# EAGLE design OSO-MISC-20-020 Programming Board for Ring (EAGLE 9.6.2)
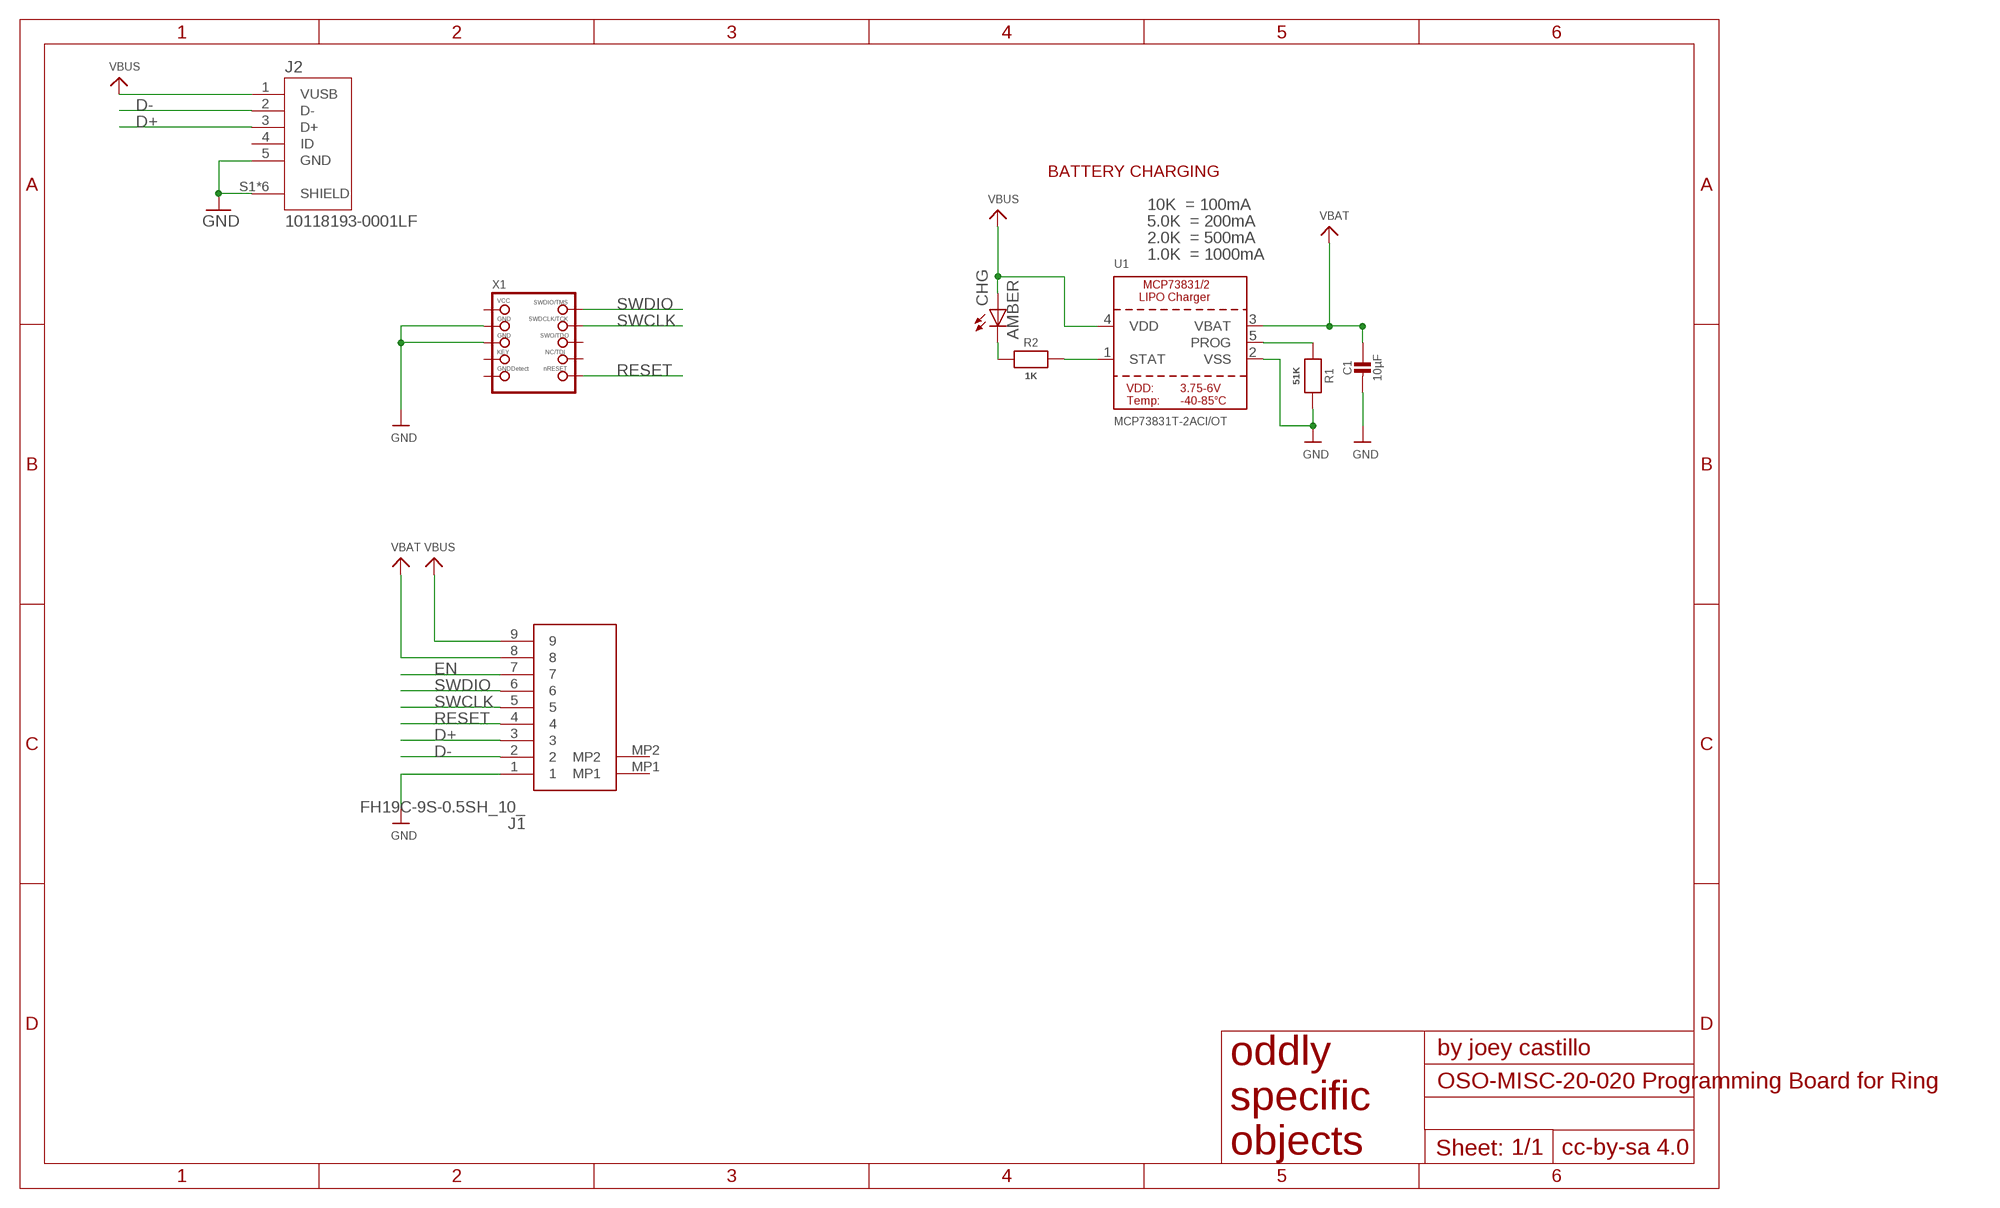
[diagram p0: schematic, sheet 1]

## Parts
C1  10µF  CAP_CERAMIC0805-NOOUTLINE  [0805-NO]
CHG  AMBER  LEDCHIPLED_0805  [CHIPLED_0805]
J1  FH19C-9S-0.5SH_10_  [FH19C9S05SH10]
J2  10118193-0001LF  [FCI_10118193-0001LF]
R1  51K  RESISTOR0805_NOOUTLINE  [0805-NO]
R2  1K  RESISTOR0805_NOOUTLINE  [0805-NO]
U1  MCP73831T-2ACI/OT  MCP73831/2  [SOT23-5]
X1  JTAG-CORTEXBOX  [2X05_1.27MM_BOX_NOPOSTS]

## Nets
D+: J1.3 J2.3(D+)
D-: J1.2 J2.2(D-)
EN: J1.7
GND [gnd]: C1.2 J1.1 J2.5(GND) J2.S1(SHIELD) J2.S2(SHIELD) J2.S3(SHIELD) J2.S4(SHIELD) J2.S5(SHIELD) J2.S6(SHIELD) R1.2 U1.2(VSS) X1.3(GND) X1.5(GND)
N$4: CHG.C R2.1
PROG: R1.1 U1.5(PROG)
RESET: J1.4 X1.10(NRESET)
STAT: R2.2 U1.1(STAT)
SWCLK: J1.5 X1.4(SWDCLK)
SWDIO: J1.6 X1.2(SWDIO)
VBAT [power]: C1.1 J1.8 U1.3(VBAT)
VBUS [power]: CHG.A J1.9 J2.1(VUSB) U1.4(VDD)
Unconnected: J1.MP1 J1.MP2 J2.4(ID) X1.6(SWO) X1.7(KEY) X1.8(TDI) X1.9(GNDDETECT)

## Notes on the sheet
- BATTERY CHARGING
- 10K  = 100mA
- 5.0K  = 200mA
- 2.0K  = 500mA
- 1.0K  = 1000mA

## Power pins joined to a net without a drawn wire
VCC: X1.1(VCC)

## Library data of the parts
C1 = microbuilder:CAP_CERAMIC: Ceramic Capacitors For new designs, use the packages preceded by an '_' character since they are more reliable: The following footprints should be used on most boards: _0402 - Standard footprint for regular board layouts _0603 - Standard footprint for regular board layouts _0805 - Standard footprint for regular board layouts _1206 - Standard footprint for regular board layouts For extremely tight-pitch boards where space is at a premium, the following 'micro-pitch' footprints can be used (smaller pads, no silkscreen outline, etc.): _0402MP - Micro-pitch footprint for very dense/compact boards _0603MP - Micro-pitch footprint for very dense/compact boards _0805MP - Micro-pitch footprint for very dense/compact boards _1206MP - Micro-pitch footprint for very dense/compact boards
CHG = adafruit:LED: LED OSRAM: - CHIPLED LG R971, LG N971, LY N971, LG Q971, LY Q971, LO R971, LY R971 LH N974, LH R974 LS Q976, LO Q976, LY Q976 LO Q996 - Hyper CHIPLED LW Q18S LB Q993, LB Q99A, LB R99A - SideLED LS A670, LO A670, LY A670, LG A670, LP A670 LB A673, LV A673, LT A673, LW A673 LH A674 LY A675 LS A676, LA A676, LO A676, LY A676, LW A676 LS A679, LY A679, LG A679 - Hyper Micro SIDELED® LS Y876, LA Y876, LO Y876, LY Y876 LT Y87S - SmartLED LW L88C, LW L88S LB L89C, LB L89S, LG L890 LS L89K, LO L89K, LY L89K LS L896, LA L896, LO L896, LY L896 - TOPLED LS T670, LO T670, LY T670, LG T670, LP T670 LSG T670, LSP T670, LSY T670, LOP T670, LYG T670 LG T671, LOG T671, LSG T671 LB T673, LV T673, LT T673, LW T673 LH T674 LS T676, LA T676, LO T676, LY T676, LB T676, LH T676, LSB T676, LW T676 LB T67C, LV T67C, LT T67C, LS T67K, LO T67K, LY T67K, LW E67C LS E67B, LA E67B, LO E67B, LY E67B, LB E67C, LV E67C, LT E67C LW T67C LS T679, LY T679, LG T679 LS T770, LO T770, LY T770, LG T770, LP T770 LB T773, LV T773, LT T773, LW T773 LH T774 LS E675, LA E675, LY E675, LS T675 LS T776, LA T776, LO T776, LY T776, LB T776 LHGB T686 LT T68C, LB T68C - Hyper Mini TOPLED® LB M676 - Mini TOPLED Santana® LG M470 LS M47K, LO M47K, LY M47K Source: http://www.osram.convergy.de/
J1 = FH19C-9S-0.5SH:FH19C-9S-0.5SH_10_: CONN FFC BOTTOM 9POS 0.50MM R/A Source: Datasheet <https://componentsearchengine.com/Datasheets/1/FH19C-9S-0.5SH(10).pdf>; DESCRIPTION: CONN FFC BOTTOM 9POS 0.50MM R/A; HEIGHT: 1mm; MANUFACTURER_NAME: Hirose; MANUFACTURER_PART_NUMBER: FH19C-9S-0.5SH(10); MOUSER_PART_NUMBER: 798-FH19C9S05SH10; MOUSER_PRICE-STOCK: https://www.mouser.co.uk/ProductDetail/Hirose-Connector/FH19C-9S-05SH10?qs=vnk2wBG9e15bX8eK%2FvDSMA%3D%3D
J2 = 10118193-0001LF:10118193-0001LF: Micro USB B Type Receptacle; DESCRIPTION: Single Port 5 Contact Shielded SMT MICRO USB B-Type Receptacle; DIGI-KEY_PART_NUMBER: 609-4616-1-ND; DIGI-KEY_PURCHASE_URL: https://www.digikey.com/product-detail/en/amphenol-icc-fci/10118193-0001LF/609-4616-1-ND/2785380?utm_source=snapeda&utm_medium=aggregator&utm_campaign=symbol; MF: Amphenol ICC; MP: 10118193-0001LF; PACKAGE: None
R1 R2 = microbuilder:RESISTOR: Resistors For new designs, use the packages preceded by an '_' character since they are more reliable: The following footprints should be used on most boards: _0402 - Standard footprint for regular board layouts _0603 - Standard footprint for regular board layouts _0805 - Standard footprint for regular board layouts _1206 - Standard footprint for regular board layouts For extremely tight-pitch boards where space is at a premium, the following 'micro-pitch' footprints can be used (smaller pads, no silkscreen outline, etc.): _0402MP - Micro-pitch footprint for very dense/compact boards _0603MP - Micro-pitch footprint for very dense/compact boards _0805MP - Micro-pitch footprint for very dense/compact boards _1206MP - Micro-pitch footprint for very dense/compact boards
U1 = microbuilder:MCP73831/2: MCP73831/2 LIPO Charger VDD: 3.75 - 6V Temp -40 - 85°C Programmable Charge Rate: 15-500mA NOTE: STAT is a tri-state logic output on the MCP73831 and an open-drain output on the MCP73832. SOT23-5 with 4.2V output and tri-state logic on STAT = MCP73831T-2ACI/OT
X1 = pygamer-microbuilder:JTAG-CORTEX: Serial Wire (SW-DP) Connector Standard 0.05" 10-pin connector is for use with the Cortex M and Cortex A SWD (serial wire debugger) interface (SW-DP) Connectors 2x05_1.27MM_SMT - Inexpensive surface-mount header with bare pins, compatible with standard 10-pin SWD cables (4UCON: 16846) 2x05_1.27MM_BOX_NOPOSTS - Polarised surface-mount box (4UCON with caps: 19735, without caps: 15117 2x05_1.27MM_BOX_POSTS - Polarised surface-mount box with mounting holes (4UCON: 20317) Pinout: http://infocenter.arm.com/help/topic/com.arm.doc.faqs/attached/13634/cortex_debug_connectors.pdf http://www.keil.com/peripherals/coresight/connectors.asp

## Net classes
1 power: width 0.254 mm
2 gnd: width 0.254 mm

## Board
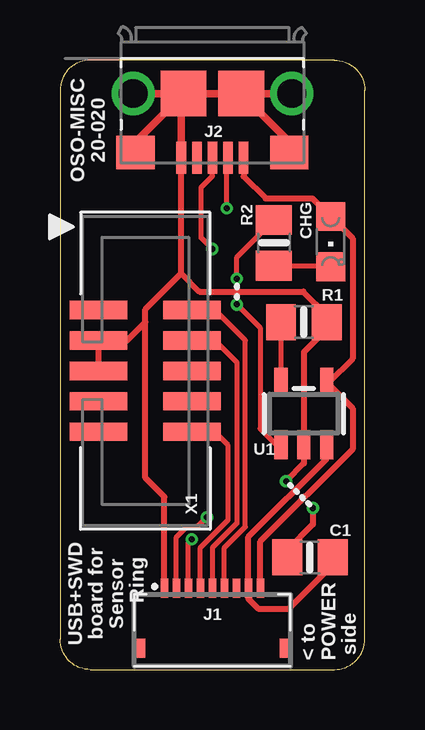
[diagram p1: board, top side]
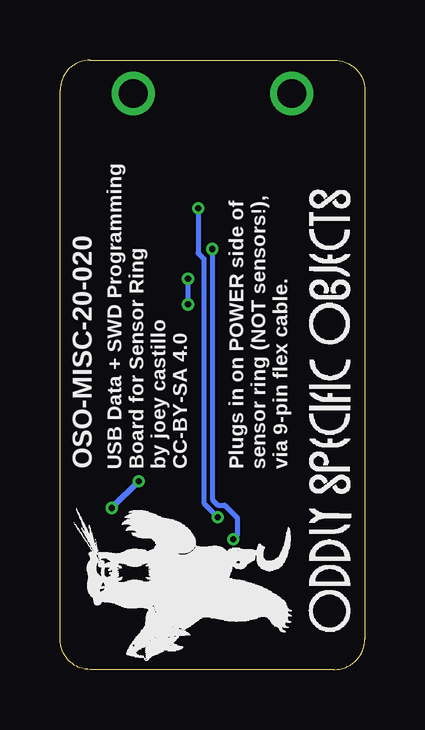
[diagram p2: board, bottom side, seen from below]

Size 12.7 x 25.4 mm. Coordinates in mm from the lower left corner, seen from the top.
Outline: 1.27,0 11.43,0 arc90 12.7,1.27 12.7,24.13 arc90 11.43,25.4 1.27,25.4 arc90 0,24.13 0,1.27 arc90 1.27,0
Copper layers (1*16): Top 0.035559375mm / dielectric 1.6mm / Bottom 0.035559375mm
Design rules "oshpark-2layer *": minimum track width 6mil, minimum drill 10mil, track to track 6mil, track to pad 6mil, pad to pad 6mil, via to via 6mil, smd to smd 6mil, copper to edge 15mil, drill to drill 6mil, minimum pad ring 5mil, minimum via ring 5mil, stop-mask expansion 2.5mil, vias tented up to drill 12mil, thermal gap 10mil

### Footprints (pad centres in the part's own frame; a part is rotated, then mirrored left to right if it is on the bottom)
0805-NO = smd 1.24 x 1.5: 1 -0.95,0; 2 0.95,0
CHIPLED_0805 = smd 1.2 x 1.2: A 0,-1.05; C 0,1.05
FH19C9S05SH10 = smd 0.3 x 0.8: 1 -2,2.5; 2 -1.5,2.5; 3 -1,2.5; 4 -0.5,2.5; 5 0,2.5; 6 0.5,2.5; 7 1,2.5; 8 1.5,2.5; 9 2,2.5 | smd 0.4 x 0.8: MP1 -3,0; MP2 3,0
FCI_10118193-0001LF = smd 0.4 x 1.35: 1 -1.3,2.675; 2 -0.65,2.675; 3 0,2.675; 4 0.65,2.675; 5 1.3,2.675 | smd 1.6 x 1.4: S1 -3.2,2.45; S2 3.2,2.45 | smd 1.9 x 1.9: S3 1.2,0; S4 -1.2,0 | drill 1.2: S5 3.302,0; S6 -3.302,0
SOT23-5 = smd 0.55 x 1.2: 1 -0.95,-1.3; 2 0,-1.3; 3 0.95,-1.3; 4 0.95,1.3; 5 -0.95,1.3
2X05_1.27MM_BOX_NOPOSTS = smd 0.76 x 2.4: 1 -2.54,-1.95; 2 -2.54,1.95; 3 -1.27,-1.95; 4 -1.27,1.95; 5 0,-1.95; 6 0,1.95; 7 1.27,-1.95; 8 1.27,1.95; 9 2.54,-1.95; 10 2.54,1.95

### Placement (x,y rotation side)
C1  10.41,4.67 180 top
CHG  11.28,17.83 180 top
J1  6.35,0.89 0 top
J2  6.35,24 180 top
R1  10.16,14.48 0 top
R2  8.92,17.78 90 top
U1  10.16,10.67 0 top
U$1  [OSO_BEAR_250X360MIL_1000DPI]  7.62,3.56 90 bottom
U$3  [OSO_WORDMARK_ONELINE_725MIL_1000DPI]  0.51,1.52 90 bottom
X1  3.56,12.45 270 top

### Tracks (layer width: path | path; a pad name or v marks a point on that pad's centre or on a via)
D+  (via drill 0.25)
  Top 0.203: J1.3 5.35,5.3 v5.48,5.44 | J2.3 6.35,20.57 5.87,20.08 5.87,18.01 v6.35,17.53
  Bottom 0.203: v5.48,5.44 5.31,5.61 5.31,6.32 5.84,6.86 6.13,6.86 6.35,7.08 v6.35,17.53
D-  (via drill 0.25)
  Top 0.203: v6.12,6.35 5.72,5.94 5.27,5.94 4.85,5.52 J1.2 | v6.94,19.22 6.94,21.27 J2.2
  Bottom 0.203: v6.12,6.35 6.62,6.84 6.71,6.93 6.71,17.12 6.94,17.36 v6.94,19.22
GND  (via drill 0.25)
  Top 0.254: X1.5 X1.3 2.79,13.72 3.56,14.48 | 3.56,14.48 3.56,15.01 5.05,16.5 | 5.05,16.5 J2.5 | 5.05,16.5 5.81,15.75 10.14,15.75 11.11,14.78 R1.2 11.11,14.17 10.16,13.22 U1.2 10.16,8.59 v9.42,7.85 | v10.54,6.73 10.54,6.05 9.46,4.98 C1.2 | J1.1 4.35,7.2 3.56,7.99 3.56,14.48
  Top 0.305: J2.S6 J2.S4 | J2.S4 9.55,22 J2.S1 | J2.S3 3.15,22 J2.S2 | J2.S5 J2.S3 | J2.S3 J2.S4 | J2.5 5.05,23.9 J2.S3
  Bottom 0.254: v9.42,7.85 v10.54,6.73
N$4
  Top 0.203: R2.1 11.23,16.83 CHG.C
PROG
  Top 0.203: U1.5 R1.1
RESET
  Top 0.203: J1.4 5.85,5.08 7.01,6.24 7.01,9.35 6.45,9.91 X1.10
STAT  (via drill 0.25)
  Top 0.203: v7.37,15.21 8.34,14.24 8.34,10.04 9.01,9.37 U1.1 | v7.37,16.28 7.37,17.18 R2.2
  Bottom 0.203: v7.37,15.21 v7.37,16.28
SWCLK
  Top 0.203: X1.4 6.45,13.72 7.37,12.8 7.37,6.1 6.35,5.08 J1.5
SWDIO
  Top 0.203: J1.6 6.85,5.08 7.72,5.95 7.72,13.72 6.45,14.99 X1.2
VBAT
  Top 0.254: U1.3 11.11,8.79 7.85,5.53 J1.8 7.85,2.94 8.25,2.54 9.52,2.54 11.36,4.38 C1.1
VBUS
  Top 0.254: J2.1 7.65,20.54 8.56,19.63 10.52,19.63 11.27,18.88 CHG.A 12.19,17.97 12.19,12.95 11.21,11.97 U1.4 12.19,10.89 12.19,9.18 8.35,5.34 J1.9

### Text on the board
tPlace: OSO-MISC / 20-020 | USB+SWD / board for / Sensor / Ring | < to / POWER / side
bPlace: Plugs in on POWER side of / sensor ring (NOT sensors\!), / via 9-pin flex cable. | USB Data + SWD Programming / Board for Sensor Ring / by joey castillo / CC-BY-SA 4.0 | OSO-MISC-20-020